# Altium schematic sheet USB_UART.SchDoc
size A4
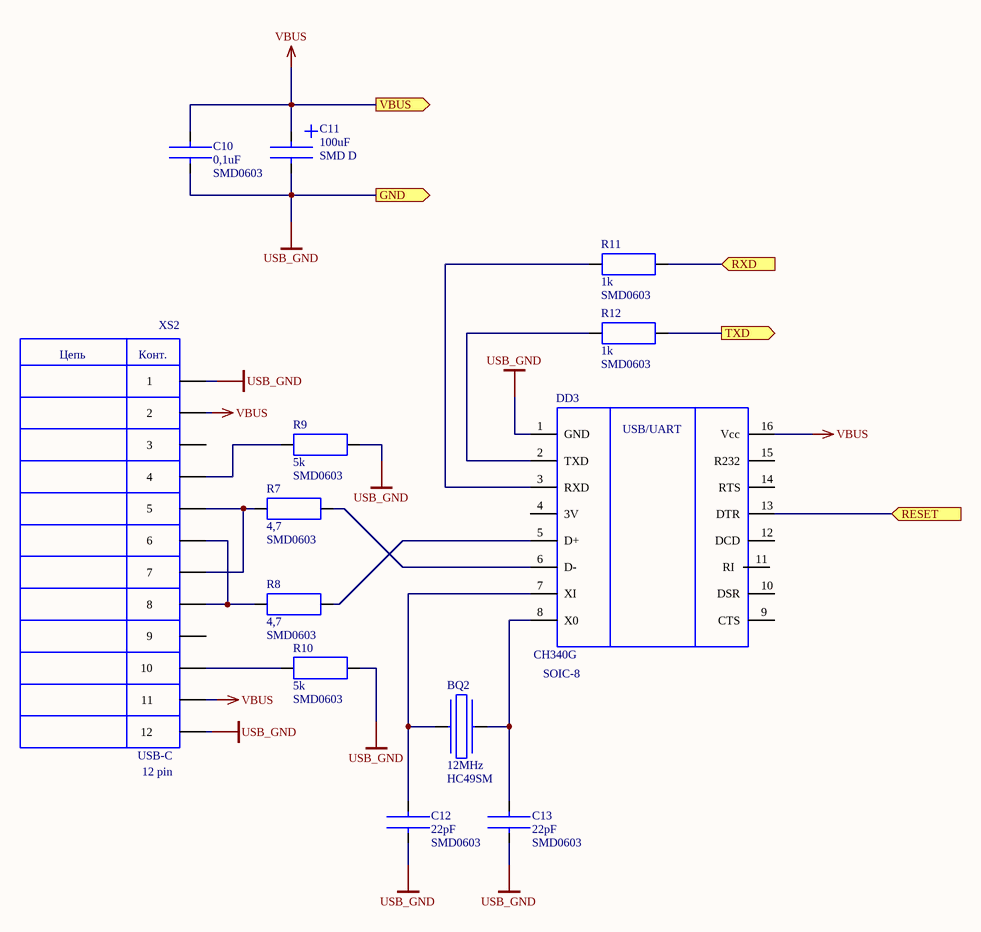
[diagram p0: USB_UART.SchDoc]

## Parts
BQ2  12МHz  Package: HC49SM  [BQ_HC49SM]
C10  0,1uF  Package: SMD0603  [SMD0603(1005)]
C11  100uF  Package: SMD D  [TANT_CAP_D(7343)]
C12  22pF  Package: SMD0603  [SMD0603(1005)]
C13  22pF  Package: SMD0603  [SMD0603(1005)]
DD3  CH340G  Package: SOIC-8  [SOIC16]
R7  4,7  Package: SMD0603  [SMD0603(1005)]
R8  4,7  Package: SMD0603  [SMD0603(1005)]
R9  5k  Package: SMD0603  [SMD0603(1005)]
R10  5k  Package: SMD0603  [SMD0603(1005)]
R11  1k  Package: SMD0603  [SMD0603(1005)]
R12  1k  Package: SMD0603  [SMD0603(1005)]
XS2  USB-C  Package: 12 pin  [USB_C]

## Ports
GND (out), RESET (in), RXD (in), TXD (out), VBUS (out)

## Nets
USB_GND: C10.1 C11.2 C12.1 C13.1 DD3.1(GND) R9.1 R10.1 XS2.1 XS2.12 ; port GND
VBUS: C10.2 C11.1 DD3.16(Vcc) XS2.2 XS2.11 ; port VBUS
RESET: DD3.13(DTR) ; port RESET
RXD: R11.1 ; port RXD
TXD: R12.1 ; port TXD
NetBQ2_1: BQ2.1 C12.2 DD3.7(XI)
NetBQ2_2: BQ2.2 C13.2 DD3.8(X0)
NetDD3_2: DD3.2(TXD) R12.2
NetDD3_3: DD3.3(RXD) R11.2
NetDD3_5: DD3.5(D+) R8.2
NetDD3_6: DD3.6(D-) R7.2
NetR7_1: R7.1 XS2.5 XS2.7
NetR8_1: R8.1 XS2.6 XS2.8
NetR9_2: R9.2 XS2.4
NetR10_2: R10.2 XS2.10

Not connected (* = marked no-connect by the designer): DD3 4(3V) 9(CTS) 10(DSR) 11(RI) 12(DCD) 14(RTS) 15(R232); XS2 3 9

## Notes on the sheet
- (in symbol USB_C) Цепь; Конт.
- (in symbol Микросхема CH340G) USB/UART

## Library data of the parts
BQ2 = BQ_HC49SM: ValueBOM: Кварцевый резонатор 12МГц HC49S; Type: BQ; Value: 12МHz
C10 = CER_CUP_0603: Type: C; ValueBOM: Конденсатор керамический 0,1мкФ SMD 0603 1%; Value: 0,1uF
C11 = C_TANT_D: Type: C; ValueBOM: Конденсатор танталовый 100мкФ х 16В 10%  SMD D; Value: 100uF
C12 C13 = CER_CUP_0603: Type: C; ValueBOM: Конденсатор керамический 22пФ SMD 0603 1%; Value: 22pF
DD3 = Микросхема CH340G: Type: DD; Value: CH340G; ValueBOM: Микросхема CH340G
R7 R8 = R_0603: ValueBOM: Резистор 4,7Ом SMD 0603 1%; Type: R; Value: 4,7
R9 R10 = R_0603: ValueBOM: Резистор 5кОм SMD 0603 1%; Type: R; Value: 5k
R11 R12 = R_0603: ValueBOM: Резистор 1кОм SMD 0603 1%; Type: R; Value: 1k
XS2 = USB_C: ValueBOM: Разъём USB type C 12 контактный; Value: USB-C; Type: XS; Link: https://www.voltmaster-samara.ru/upload/iblock/68a/68a6841d20080b30588d6f36d0bc1a38.pdf